# Altium schematic sheet Power management.SchDoc
size A4; SheetNumber: 2; SheetTotal: 5
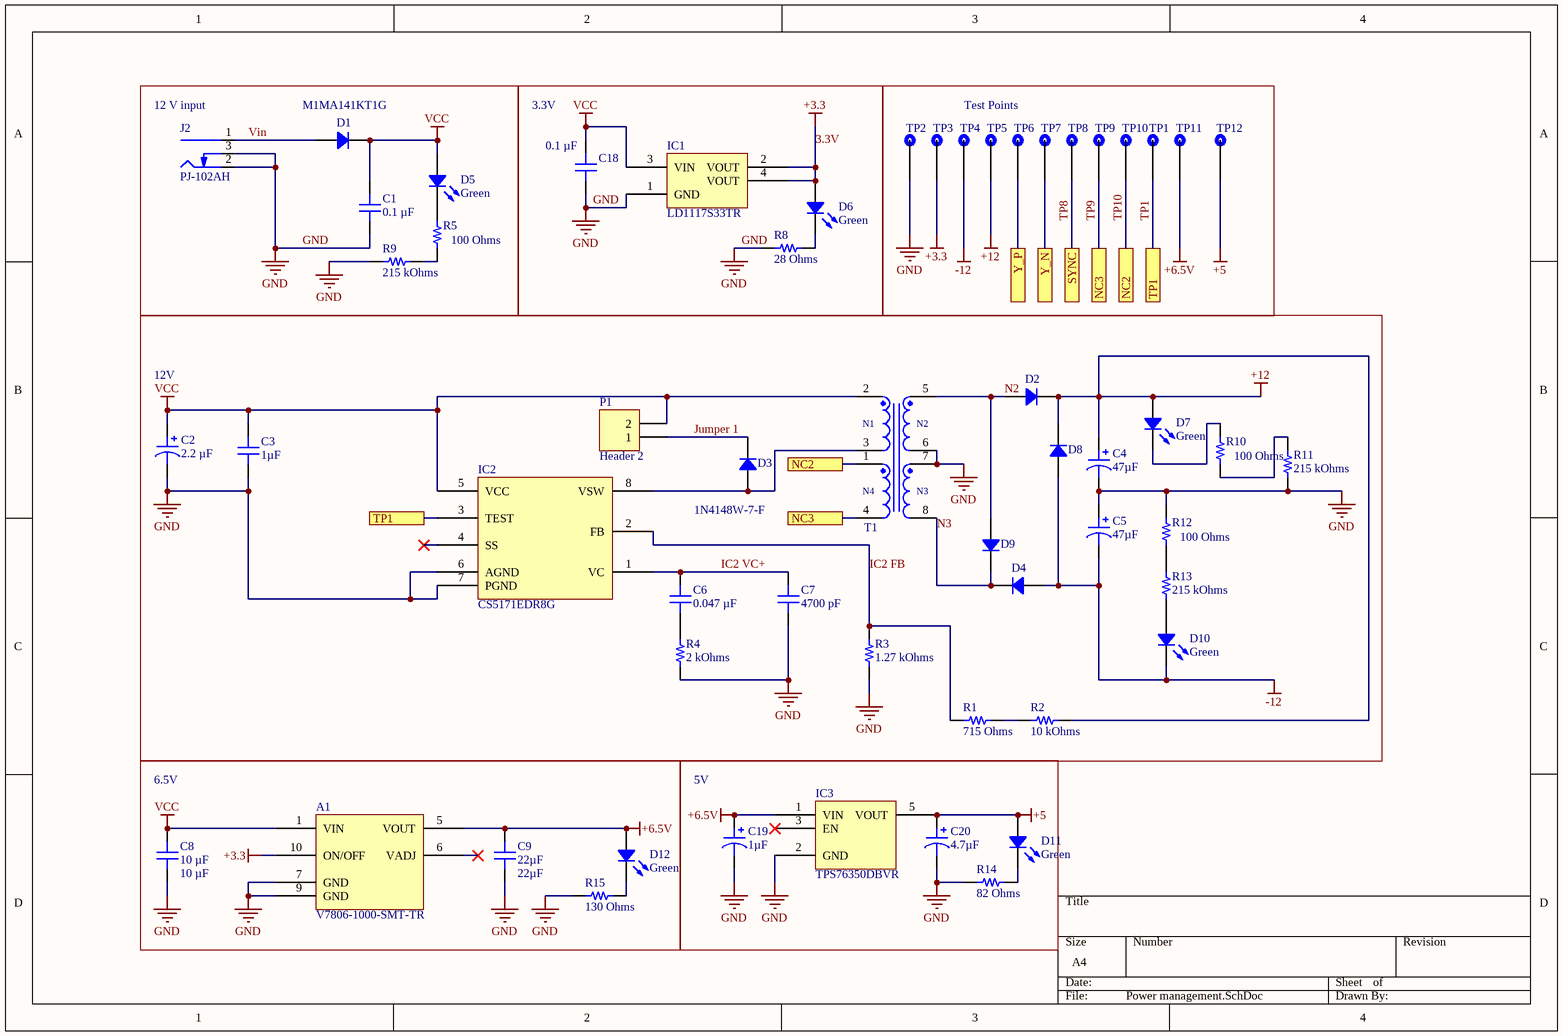
[diagram p0: Power management.SchDoc]

## Parts
A1  V7806-1000-SMT-TR  [CUI V78]
C1  0.1 µF  [CAP 0805_2012]
C2  2.2 µF  [CAP AL TH D8 L3.5 H12.5]
C3  1µF  [CAP 1206_3216 - 1.0MM]
C4  47µF  [CAP TH ALUM ELEC D6.30mm S2.50mm H12.70mm]
C5  47µF  [CAP TH ALUM ELEC D6.30mm S2.50mm H12.70mm]
C6  0.047 µF  [CAP 1206_3216 - 0.8MM]
C7  4700 pF  [CAP 1206_3216 - 0.8MM]
C8  10 µF  [CAP 1210_3225 - 1MM]
C9  22µF  [CAP 1210_3225 - 2.8MM]
C18  0.1 µF  [CAP 1210_3225 - 1MM]
C19  1µF  [CAP TH ALUM ELEC D4.00mm S1.50mm H6.00mm]
C20  4.7µF  [CAP TH ALUM ELEC D4.00mm S1.50mm H6.00mm]
D1  M1MA141KT1G  [DIODES SOT-323-3]
D2  MBRS140T3G  [DO214AA SMB]  (value not drawn)
D3  1N4148W-7-F  [SOD-123]
D4  MBRS140T3G  [DO214AA SMB]  (value not drawn)
D5  Green  [LED 1206_3216 GREEN]
D6  Green  [LED 1206_3216 GREEN]
D7  Green  [LED 1206_3216 GREEN]
D8  MBRS140T3G  [DO214AA SMB]  (value not drawn)
D9  MBRS140T3G  [DO214AA SMB]  (value not drawn)
D10  Green  [LED 1206_3216 GREEN]
D11  Green  [LED 1206_3216 GREEN]
D12  Green  [LED 1206_3216 GREEN]
IC1  LD1117S33TR  [ST SOT-223]
IC2  CS5171EDR8G  [ON SEMI SO-8]
IC3  TPS76350DBVR  [TI SOT-23-5 DBV]
J2  PJ-102AH  [CUI PJ-102AH]
P1  Header 2  [HDR1X2]
R1  715 Ohms  [RES 1210_3225]
R2  10 kOhms  [RES 1210_3225]
R3  1.27 kOhms  [RES 1210_3225]
R4  2 kOhms  [RES 1210_3225]
R5  100 Ohms  [RES 2512_6432]
R8  28 Ohms  [RES 2512_6432]
R9  215 kOhms  [RES 2512_6432]
R10  100 Ohms  [RES 2512_6432]
R11  215 kOhms  [RES 2512_6432]
R12  100 Ohms  [RES 2512_6432]
R13  215 kOhms  [RES 2512_6432]
R14  82 Ohms  [RES 2512_6432]
R15  130 Ohms  [RES 2512_6432]
T1  Ui = 30-57V, Uo1 = 12V/5A, Uo2 = -12V/1.6A  [WE-PoE++_EFD20_THT_L21.08W21.08H10.8]  (value not drawn)
TP1  TP_1  [Test_point_1]  (value not drawn)  (no BOM)
TP2  TP_1  [Test_point_1]  (value not drawn)  (no BOM)
TP3  TP_1  [Test_point_1]  (value not drawn)  (no BOM)
TP4  TP_1  [Test_point_1]  (value not drawn)  (no BOM)
TP5  TP_1  [Test_point_1]  (value not drawn)  (no BOM)
TP6  TP_1  [Test_point_1]  (value not drawn)  (no BOM)
TP7  TP_1  [Test_point_1]  (value not drawn)  (no BOM)
TP8  TP_1  [Test_point_1]  (value not drawn)  (no BOM)
TP9  TP_1  [Test_point_1]  (value not drawn)  (no BOM)
TP10  TP_1  [Test_point_1]  (value not drawn)  (no BOM)
TP11  TP_1  [Test_point_1]  (value not drawn)  (no BOM)
TP12  TP_1  [Test_point_1]  (value not drawn)  (no BOM)

## Blocks framed on the sheet
12 V input: C1 D1 D5 J2 R5 R9
3.3V: C18 D6 IC1 R8
Test Points: TP1-TP12
12V: C2-C7 D2-D4 D7-D10 IC2 P1 R1-R4 R10-R13 T1
6.5V: A1 C8 C9 D12 R15
5V: C19 C20 D11 IC3 R14

## Ports
NC2, NC3, SYNC, TP1, Y_N, Y_P

## Nets
3.3V: A1.10(ON/OFF) D6.1 IC1.2(VOUT) IC1.4(VOUT) TP3.TP1(P1)  [also labelled +3.3]
+5: C20.1 D11.1 IC3.5(VOUT) TP12.TP1(P1)
+6.5V: A1.5(VOUT) C9.2 C19.1 D12.1 IC3.1(VIN) TP11.TP1(P1)
+12: C4.1 D2.2 D7.1 D8.2 R2.2 TP5.TP1(P1)
-12: C5.2 D4.1 D8.1 D10.2 TP4.TP1(P1)
GND: A1.7(GND) A1.9(GND) C1.1 C2.2 C3.1 C4.2 C5.1 C7.1 C8.1 C9.1 C18.1 C19.2 C20.2 IC1.1(GND) IC2.6(AGND) IC2.7(PGND) IC3.2(GND) J2.2(Outer) J2.3(SW) R3.1 R4.1 R8.1 R9.1 R11.1 R12.2 R14.1 R15.1 T1.6 T1.7 TP2.TP1(P1)
VCC: A1.1(VIN) C1.2 C2.1 C3.2 C8.2 C18.2 D1.2 D5.1 IC1.3(VIN) IC2.5(VCC) P1.2 T1.2
IC2 FB: IC2.2(FB) R1.1 R3.2
IC2 VC+: C6.2 C7.2 IC2.1(VC)
Jumper 1: D3.2 P1.1
N2: D2.1 D9.1 T1.5
N3: D4.2 D9.2 T1.8
TP1: IC2.3(TEST) TP1.TP1(P1) ; port TP1
TP8: TP8.TP1(P1) ; port SYNC
TP9: T1.4 TP9.TP1(P1) ; port NC3
TP10: T1.1 TP10.TP1(P1) ; port NC2
Vin: D1.1 J2.1(Centre)
Y_N: TP7.TP1(P1) ; port Y_N
Y_P: TP6.TP1(P1) ; port Y_P
NetC6_1: C6.1 R4.2
NetD3_1: D3.1 IC2.8(VSW) T1.3
NetD5_2: D5.2 R5.2
NetD6_2: D6.2 R8.2
NetD7_2: D7.2 R10.2
NetD10_1: D10.1 R13.1
NetD11_2: D11.2 R14.2
NetD12_2: D12.2 R15.2
NetR1_2: R1.2 R2.1
NetR5_1: R5.1 R9.2
NetR10_1: R10.1 R11.2
NetR12_1: R12.1 R13.2

Not connected (* = marked no-connect by the designer): A1 6(VADJ)*; IC2 4(SS)*; IC3 3(EN)*

## Notes on the sheet
- (in symbol 750310042) N1; N2; N4; N3

## Library data of the parts
A1 = V7806-1000-SMT-TR: DC DC CONVERTER 6.5V 7W; Part Number: V7806-1000-SMT-TR
C1 = C0805X104K5RAC7210: .100UF 50.0V; manufacturer: KEMET; Temperature Coefficient: X7R; Tolerance: ±10%; Voltage - Rated: 50V; Part Number: C0805X104K5RAC7210; Value: 0.1 µF; Applications: Boardflex Sensitive; Capacitance: 0.1 µF; componentlink1description: Datasheet; componentlink1url: https://connect.kemet.com:7667/gateway/IntelliData-ComponentDocumentation/1.0/download/datasheet/C0805X104K5RAC7210; componentlink2description: DigiKey Link; componentlink2url: https://www.digikey.com/en/products/detail/kemet/C0805X104K5RAC7210/12082600; Device Package: 0805 (2012 Metric); Features: Soft Termination; lastupdated: 9/02/2024 8:14:45 PM; Lifecycle Status: Active; Minimum Order: 1; Mounting Type: Surface Mount, MLCC; Operating Temperature: -55°C ~ 125°C; Package / Case: 0805 (2012 Metric); packaging: TapeAndReel; partid: 48810; Part Status: Active; price: 0.05; series: SMD Comm X7R Flex; Size / Dimension: 0.079" L x 0.049" W (2.00mm x 1.25mm); Supplier 1: DigiKey; Supplier Part Number 1: 399-C0805X104K5RAC7210CT-ND; Thickness (Max): 0.039" (0.98mm)
C2 = UVY2G2R2MPD: CAP ALUM 2.2UF 20% 400V RADIAL; manufacturer: Nichicon; Lifetime @ Temp.: 1000 Hrs @ 105°C; Polarization: Polar; Ripple Current @ High Frequency: 31.05 mA @ 10 kHz; Ripple Current @ Low Frequency: 27 mA @ 120 Hz; Part Number: UVY2G2R2MPD; Applications: General Purpose; Capacitance: 2.2 µF; componentlink1description: Datasheet; componentlink1url: http://nichicon-us.com/english/products/pdfs/e-uvy.pdf; componentlink2description: DigiKey Link; componentlink2url: https://www.digikey.com/en/products/detail/nichicon/UVY2G2R2MPD/2539761; Device Package: Radial, Can; Height - Seated (Max): 0.492" (12.50mm); lastupdated: 8/02/2024 9:38:05 PM; Lead Spacing: 0.138" (3.50mm); Lifecycle Status: Active; Minimum Order: 1; Mounting Type: Through Hole; Operating Temperature: -40°C ~ 105°C; Package / Case: Radial, Can; packaging: Bulk; partid: 7299; Part Status: Active; price: 0.15; series: UVY; Size / Dimension: 0.315" Dia (8.00mm); Supplier 1: DigiKey; Supplier Part Number 1: 493-16197-ND; Tolerance: ±20%; value: 2.2 µF; Voltage - Rated: 400 V
C3 = 12065C105K4Z2A: CAP CER 1UF 50V X7R 1206; manufacturer: AVX Corporation; Tolerance: ±10%; Part Number: 12065C105K4Z2A; Value: 1µF; Applications: Automotive, Boardflex Sensitive; Capacitance: 1µF; componentlink1description: Datasheet; componentlink1url: http://datasheets.avx.com/AutoMLCC.pdf; componentlink2description: DigiKey Link; componentlink2url: http://digikey.com/product-detail/en/avx-corporation/12065C105K4Z2A/478-10886-1-ND/7536455; Device Package: 1206 (3216 Metric); Features: Soft Termination; lastupdated: 2/09/2020 1:05:06 AM; Lifecycle Status: Active; Minimum Order: 1; Mounting Type: Surface Mount, MLCC; Operating Temperature: -55°C ~ 125°C; Package / Case: 1206 (3216 Metric); packaging: TapeAndReel; partid: 18944; Part Status: Active; price: 0.12; Ratings: AEC-Q200; series: FLEXITERM®; Size / Dimension: 0.126" L x 0.063" W (3.20mm x 1.60mm); Supplier 1: DigiKey; Supplier Part Number 1: 478-10886-1-ND; Temperature Coefficient: X7R; Thickness (Max): 0.037" (0.94mm); Voltage - Rated: 50V
C4 C5 = EEU-FR1H470: AL LYTIC, RADIAL, 50VDC, 47UF; manufacturer: Panasonic Electronic Components; Impedance: 140 mOhms; Lifetime @ Temp.: 5000 Hrs @ 105°C; Polarization: Polar; Ripple Current @ High Frequency: 405mA @ 100kHz; Ripple Current @ Low Frequency: 283.5mA @ 120Hz; Tolerance: ±20%; Voltage - Rated: 50V; Part Number: EEU-FR1H470; Applications: General Purpose; Capacitance: 47µF; componentlink1description: Datasheet; componentlink1url: https://industrial.panasonic.com/cdbs/www-data/pdf/RDF0000/ABA0000C1022.pdf; componentlink2description: DigiKey Link; componentlink2url: http://digikey.com/product-detail/en/panasonic-electronic-components/EEU-FR1H470/P124235-ND/9921029; Device Package: Radial, Can; Height - Seated (Max): 0.500" (12.70mm); lastupdated: 4/09/2020 1:05:46 AM; Lead Spacing: 0.098" (2.50mm); Lifecycle Status: Active; Minimum Order: 1; Mounting Type: Through Hole; Operating Temperature: -40°C ~ 105°C; Package / Case: Radial, Can; packaging: Bulk; partid: 20220; Part Status: Active; price: 0.31; series: FR; Size / Dimension: 0.248" Dia (6.30mm); Supplier 1: DigiKey; Supplier Part Number 1: P124235-ND; value: 47µF
C6 = C1206C473K5RECAUTO: CAP CER 1206 47NF 50V X7R 10%; manufacturer: KEMET; Part Number: C1206C473K5RECAUTO; Value: 0.047 µF; Applications: Automotive, ESD Protection; Capacitance: 0.047 µF; componentlink1description: Datasheet; componentlink1url: https://api.kemet.com/component-edge/download/datasheet/C1206C473K5RECAUTO.pdf; componentlink2description: DigiKey Link; componentlink2url: https://www.digikey.com/en/products/detail/kemet/C1206C473K5RECAUTO/8640487; Device Package: 1206 (3216 Metric); lastupdated: 9/02/2024 8:18:49 PM; Lifecycle Status: Active; Minimum Order: 1; Mounting Type: Surface Mount, MLCC; Operating Temperature: -55°C ~ 125°C; Package / Case: 1206 (3216 Metric); packaging: TapeAndReel; partid: 19026; Part Status: Active; price: 0.03; Ratings: AEC-Q200; series: ESD SMD Auto X7R; Size / Dimension: 0.126" L x 0.063" W (3.20mm x 1.60mm); Supplier 1: DigiKey; Supplier Part Number 1: 399-17893-1-ND; Temperature Coefficient: X7R; Thickness (Max): 0.043" (1.10mm); Tolerance: ±10%; Voltage - Rated: 50V
C7 = GMC31CG472G50NT: CAP1206 COG 4700PF 2% 50V; manufacturer: Cal-Chip Electronics, Inc.; Temperature Coefficient: C0G, NP0; Part Number: GMC31CG472G50NT; Value: 4700 pF; Applications: General Purpose; Capacitance: 4700 pF; componentlink1description: Datasheet; componentlink1url: https://88ce57.p3cdn1.secureserver.net/wp-content/uploads/2023/01/gmc_series-2.pdf; componentlink2description: DigiKey Link; componentlink2url: https://www.digikey.com/en/products/detail/cal-chip-electronics-inc/GMC31CG472G50NT/19910712; Device Package: 1206 (3216 Metric); lastupdated: 9/02/2024 8:17:50 PM; Lifecycle Status: Active; Minimum Order: 1; Mounting Type: Surface Mount, MLCC; Operating Temperature: -55°C ~ 125°C; Package / Case: 1206 (3216 Metric); packaging: TapeAndReel; partid: 56643; price: 0.05; series: GMC; Size / Dimension: 0.126" L x 0.063" W (3.20mm x 1.60mm); Supplier 1: DigiKey; Supplier Part Number 1: 4713-GMC31CG472G50NTCT-ND; Thickness (Max): 0.037" (0.95mm); Tolerance: ±2%; Voltage - Rated: 50V
C8 = GCJ32EC71H106KA01L: CAP CER 10UF 50V X7S 1210; Part Number: GCJ32EC71H106KA01L; Value: 10 µF
C9 = 12103D226KAT2A: CAP CER 22UF 25V X5R 1210; Part Number: 12103D226KAT2A; Value: 22µF
C18 = C1210J104K2RAC7800: .100UF  200V; manufacturer: KEMET; Temperature Coefficient: X7R; Tolerance: ±10%; Part Number: C1210J104K2RAC7800; Value: 0.1 µF; Applications: Boardflex Sensitive; Capacitance: 0.1 µF; componentlink1description: Datasheet; componentlink1url: https://connect.kemet.com:7667/gateway/IntelliData-ComponentDocumentation/1.0/download/datasheet/C1210J104K2RAC7800; componentlink2description: DigiKey Link; componentlink2url: https://www.digikey.com/en/products/detail/kemet/C1210J104K2RAC7800/12082491; Device Package: 1210 (3225 Metric); Features: Open Mode, Soft Termination; lastupdated: 4/06/2024 7:20:48 PM; Lifecycle Status: Active; Minimum Order: 1; Mounting Type: Surface Mount, MLCC; Operating Temperature: -55°C ~ 125°C; Package / Case: 1210 (3225 Metric); packaging: TapeAndReel; partid: 49670; Part Status: Active; price: 0.24; series: SMD Comm X7R FO; Size / Dimension: 0.130" L x 0.102" W (3.30mm x 2.60mm); Supplier 1: DigiKey; Supplier Part Number 1: 399-C1210J104K2RAC7800CT-ND; Thickness (Max): 0.057" (1.45mm); Voltage - Rated: 200V
C19 = UMF1V010MDD: CAP ALUM 1UF 20% 35V RADIAL; manufacturer: Nichicon; Impedance: 5 Ohms; Lifetime @ Temp.: 1000 Hrs @ 105°C; Polarization: Polar; Ripple Current @ High Frequency: 50mA @ 100kHz; Ripple Current @ Low Frequency: 25mA @ 120Hz; Part Number: UMF1V010MDD; Applications: General Purpose; Capacitance: 1µF; componentlink1description: Datasheet; componentlink1url: http://nichicon-us.com/english/products/pdfs/e-umf.pdf; componentlink2description: DigiKey Link; componentlink2url: http://digikey.com/product-detail/en/nichicon/UMF1V010MDD/493-15541-ND/2598666; Device Package: Radial, Can; Height - Seated (Max): 0.236" (6.00mm); lastupdated: 6/09/2020 1:48:30 AM; Lead Spacing: 0.059" (1.50mm); Lifecycle Status: Active; Minimum Order: 1; Mounting Type: Through Hole; Operating Temperature: -55°C ~ 105°C; Package / Case: Radial, Can; packaging: Bulk; partid: 23219; Part Status: Active; price: 0.42; series: UMF; Size / Dimension: 0.157" Dia (4.00mm); Supplier 1: DigiKey; Supplier Part Number 1: 493-15541-ND; Tolerance: ±20%; value: 1µF; Voltage - Rated: 35V
C20 = UMF1V4R7MDD: CAP ALUM 4.7UF 20% 35V RADIAL; manufacturer: Nichicon; Impedance: 5 Ohms; Lifetime @ Temp.: 1000 Hrs @ 105°C; Polarization: Polar; Ripple Current @ High Frequency: 50mA @ 100kHz; Ripple Current @ Low Frequency: 25mA @ 120Hz; Part Number: UMF1V4R7MDD; Applications: General Purpose; Capacitance: 4.7µF; componentlink1description: Datasheet; componentlink1url: http://nichicon-us.com/english/products/pdfs/e-umf.pdf; componentlink2description: DigiKey Link; componentlink2url: http://digikey.com/product-detail/en/nichicon/UMF1V4R7MDD/493-15545-ND/2598673; Device Package: Radial, Can; Height - Seated (Max): 0.236" (6.00mm); lastupdated: 6/09/2020 1:48:30 AM; Lead Spacing: 0.059" (1.50mm); Lifecycle Status: Active; Minimum Order: 1; Mounting Type: Through Hole; Operating Temperature: -55°C ~ 105°C; Package / Case: Radial, Can; packaging: Bulk; partid: 23153; Part Status: Active; price: 0.42; series: UMF; Size / Dimension: 0.157" Dia (4.00mm); Supplier 1: DigiKey; Supplier Part Number 1: 493-15545-ND; Tolerance: ±20%; value: 4.7µF; Voltage - Rated: 35V
D1 = M1MA141KT1G: DIODE GEN PURP 40V 100MA SC70-3; Manufacturer: ON Semiconductor; Current - Average Rectified (Io): 100mA (DC); Current - Reverse Leakage @ Vr: 100nA @ 35V; Diode Type: Standard; Reverse Recovery Time (trr): 3ns; Speed: Small Signal =< 200mA (Io), Any Speed; Voltage - Forward (Vf) (Max) @ If: 1.2V @ 100mA; Part Number: M1MA141KT1G; ComponentLink1Description: Datasheet; ComponentLink1URL: http://www.onsemi.com/pub/Collateral/M1MA141KT1-D.PDF; ComponentLink2Description: DigiKey Link; ComponentLink2URL: http://digikey.com/product-detail/en/on-semiconductor/M1MA141KT1G/M1MA141KT1GOSCT-ND/917953; LastUpdated: 8/02/2024 9:34:01 PM; Lifecycle Status: Active; Minimum Order: 1; Mounting Type: Surface Mount; Operating Temperature - Junction: 150°C (Max); Package / Case: SC-70, SOT-323; Packaging: TapeAndReel; PartId: 8; Part Status: Active; Price: 0.03; Series: -; Supplier 1: DigiKey; Supplier Part Number 1: M1MA141KT1GOSCT-ND; Supplier Device Package: SC-70-3 (SOT323); Voltage - DC Reverse (Vr) (Max): 40V
D2 D4 D8 D9 = MBRS140T3G: DIODE SCHOTTKY 40V 1A SMB; Manufacturer: ON Semiconductor; Current - Reverse Leakage @ Vr: 1mA @ 40V; Speed: Fast Recovery =< 500ns, > 200mA (Io); Voltage - Forward (Vf) (Max) @ If: 600mV @ 1A; Part Number: MBRS140T3G; ComponentLink1Description: Datasheet; ComponentLink1URL: https://www.onsemi.com/pub/Collateral/MBRS140T3-D.PDF; ComponentLink2Description: DigiKey Link; ComponentLink2URL: http://digikey.com/product-detail/en/on-semiconductor/MBRS140T3G/MBRS140T3GOSCT-ND/918002; Current - Average Rectified (Io): 1A; Diode Type: Schottky; LastUpdated: 8/02/2024 9:26:46 PM; Lifecycle Status: Active; Minimum Order: 1; Mounting Type: Surface Mount; Operating Temperature - Junction: -65°C ~ 125°C; Package / Case: DO-214AA, SMB; Packaging: TapeAndReel; PartId: 1387; Part Status: Active; Price: 0.08; Series: -; Supplier 1: DigiKey; Supplier Part Number 1: MBRS140T3GOSCT-ND; Supplier Device Package: SMB; Voltage - DC Reverse (Vr) (Max): 40V
D3 = 1N4148W-7-F: DIODE GEN PURP 100V 300MA SOD123; Manufacturer: Diodes Incorporated; Capacitance @ Vr, F: 2pF @ 0V, 1MHz; Current - Reverse Leakage @ Vr: 1 µA @ 100 V; Diode Type: Standard; Reverse Recovery Time (trr): 4 ns; Speed: Fast Recovery =< 500ns, > 200mA (Io); Voltage - Forward (Vf) (Max) @ If: 1.25 V @ 150 mA; Part Number: 1N4148W-7-F; ComponentLink1Description: Datasheet; ComponentLink1URL: https://www.diodes.com/assets/Datasheets/ds30086.pdf; ComponentLink2Description: DigiKey Link; ComponentLink2URL: https://www.digikey.com/en/products/detail/diodes-incorporated/1N4148W-7-F/814371; Current - Average Rectified (Io): 300mA; LastUpdated: 8/02/2024 9:27:29 PM; Lifecycle Status: Active; Minimum Order: 1; Mounting Type: Surface Mount; Operating Temperature - Junction: -55°C ~ 150°C; Package / Case: SOD-123; Packaging: TapeAndReel; PartId: 1002; Part Status: Active; Price: 0.02; Series: -; Supplier 1: DigiKey; Supplier Part Number 1: 1N4148W-FDICT-ND; Supplier Device Package: SOD-123; Voltage - DC Reverse (Vr) (Max): 100 V
D5-D7 D10-D12 = XZVG60W: LED GREEN CLEAR 2SMD; Manufacturer: SunLED; Configuration: Standard; Current - Test: 20mA; Lens Color: Colorless; Lens Size: 2.00mm x 1.50mm; Lens Style: Rectangle with Flat Top; Millicandela Rating: 118mcd; Viewing Angle: 70°; Voltage - Forward (Vf) (Typ): 2.1V; Wavelength - Dominant: 570nm; Wavelength - Peak: 574nm; Part Number: XZVG60W; Color: Green; ComponentLink1Description: Datasheet; ComponentLink1URL: https://www.sunledusa.com/products/spec/XZVG60W.pdf; ComponentLink2Description: DigiKey Link; ComponentLink2URL: https://www.digikey.com/en/products/detail/sunled/XZVG60W/4902123; Device Package: 1206 (3216 Metric); Height (Max): 1.40mm; LastUpdated: 3/06/2024 7:59:11 PM; Lens Transparency: Clear; Lifecycle Status: Active; Minimum Order: 1; Mounting Type: Surface Mount; Package / Case: 1206 (3216 Metric); Packaging: TapeAndReel; PartId: 1002; Part Status: Active; Price: 0.07; Series: -; Size / Dimension: 3.00mm L x 1.50mm W; Supplier 1: DigiKey; Supplier Part Number 1: 1497-1398-1-ND; Supplier Device Package: 2-SMD; Value: Green
IC1 = LD1117S33TR: IC REG LINEAR 3.3V 800MA SOT223; Manufacturer: STMicroelectronics; Current - Quiescent (Iq): 10 mA; Number of Regulators: 1; Output Configuration: Positive; Output Type: Fixed; Protection Features: Over Current, Over Temperature; PSRR: 75dB (120Hz); Voltage Dropout (Max): 1.2V @ 800mA; Voltage - Input (Max): 15V; Part Number: LD1117S33TR; ComponentLink1Description: Datasheet; ComponentLink1URL: http://www.st.com/content/ccc/resource/technical/document/datasheet/99/3b/7d/91/91/51/4b/be/CD00000544.pdf/files/CD00000544.pdf/jcr:content/translations/en.CD00000544.pdf; ComponentLink2Description: DigiKey Link; ComponentLink2URL: https://www.digikey.com/en/products/detail/stmicroelectronics/LD1117S33TR/585766; Current - Output: 800mA; LastUpdated: 3/06/2024 8:14:20 PM; Lifecycle Status: Active; Minimum Order: 1; Mounting Type: Surface Mount; Operating Temperature: 0°C ~ 125°C; Package / Case: TO-261-4, TO-261AA; Packaging: TapeAndReel; Part Status: Active; Price: 0.13; Series: -; Supplier 1: DigiKey; Supplier Part Number 1: 497-1242-1-ND; Supplier Device Package: SOT-223; Voltage - Output (Min/Fixed): 3.3V
IC2 = CS5171EDR8G: IC REG MULT CONFG ADJ 1.5A 8SOIC; Manufacturer: ON Semiconductor; Current - Output: 1.5A (Switch); Frequency - Switching: 280kHz; Function: Step-Up, Step-Down, Step-Up/Step-Down; Number of Outputs: 1; Output Configuration: Positive or Negative; Output Type: Adjustable; Synchronous Rectifier: No; Topology: Buck, Boost, Flyback, Forward Converter, SEPIC; Voltage - Input (Max): 30V; Voltage - Input (Min): 2.7V; Voltage - Output (Max): 40V (Switch); Voltage - Output (Min/Fixed): 1.28V; Part Number: CS5171EDR8G; ComponentLink1Description: Datasheet; ComponentLink1URL: http://www.onsemi.com/pub/Collateral/CS5171-D.PDF; ComponentLink2Description: DigiKey Link; ComponentLink2URL: //digikey.com/product-detail/en/on-semiconductor/CS5171EDR8G/CS5171EDR8GOSTR-ND/918422; Device Package: 8-SOIC (0.154", 3.90mm Width); LastUpdated: 12/12/2019 8:27:18 AM; Lifecycle Status: 0; Minimum Order: 1; Mounting Type: Surface Mount; Operating Temperature: -40°C ~ 125°C (TJ); Package / Case: 8-SOIC (0.154", 3.90mm Width); Packaging: TapeAndReel; Part Status: Active; Price: 0.97; Series: -; Supplier 1: DigiKey; Supplier Part Number 1: CS5171EDR8GOSTR-ND; Supplier Device Package: 8-SOIC
IC3 = TPS76350DBVR: IC REG LINEAR 5V 150MA SOT23-5; Manufacturer: Texas Instruments; Control Features: Enable; Current - Quiescent (Iq): 100 µA; Current - Supply (Max): 140 µA; Number of Regulators: 1; Output Configuration: Positive; Output Type: Fixed; Protection Features: Over Current, Over Temperature, Reverse Polarity; PSRR: 60dB (1kHz); Voltage Dropout (Max): 0.3V @ 150mA; Voltage - Input (Max): 10V; Part Number: TPS76350DBVR; ComponentLink1Description: Datasheet; ComponentLink1URL: http://www.ti.com/general/docs/suppproductinfo.tsp?distId=10&gotoUrl=http%3A%2F%2Fwww.ti.com%2Flit%2Fgpn%2Ftps763; ComponentLink2Description: DigiKey Link; ComponentLink2URL: https://www.digikey.com/en/products/detail/texas-instruments/TPS76350DBVR/382163; Current - Output: 150mA; LastUpdated: 3/06/2024 8:14:19 PM; Lifecycle Status: Active; Minimum Order: 1; Mounting Type: Surface Mount; Operating Temperature: -40°C ~ 125°C; Package / Case: SC-74A, SOT-753; Packaging: TapeAndReel; Part Status: Active; Price: 0.22; Series: -; Supplier 1: DigiKey; Supplier Part Number 1: 296-11023-1-ND; Supplier Device Package: SOT-23-5; Voltage - Output (Min/Fixed): 5V
J2 = PJ-102AH: CONN PWR JACK 2X5.5MM SOLDER; Manufacturer: CUI Devices; Actual Diameter: 0.079" (2.00mm ID), 0.256" (6.50mm OD); Current Rating (Amps): 5A; Gender: Male; Industry Recognized Mating Diameter: 2.00mm ID (0.079"), 5.50mm OD (0.217"); Internal Switch(s): Single Switch, Normally Closed; Material Flammability Rating: UL94 V-0; Mating Length/Depth: 0.354" (9.00mm); Number of Positions/Contacts: 2 Conductors, 3 Contacts; Shielding: Unshielded; Voltage - Rated: 24VDC; Part Number: PJ-102AH; ComponentLink1Description: Datasheet; ComponentLink1URL: https://www.cuidevices.com/product/resource/digikeypdf/pj-102ah.pdf; ComponentLink2Description: DigiKey Link; ComponentLink2URL: //digikey.com/product-detail/en/cui-devices/PJ-102AH/CP-102AH-ND/408448; Connector Type: Jack; LastUpdated: 16/12/2019 7:01:27 PM; Lifecycle Status: 0; Minimum Order: 1; Mounting Type: Through Hole, Right Angle; Packaging: Tray; Part Status: Active; Price: 0.76; Series: -; Supplier 1: DigiKey; Supplier Part Number 1: CP-102AH-ND; Termination: Solder
P1 = Header 2: Header, 2-Pin; LatestRevisionDate: 17-Jul-2002; LatestRevisionNote: Re-released for DXP Platform.; Publisher: Altium Limited
R1 = CRCW1210715RFKEA: RES SMD 715 OHM 1% 1/2W 1210; Manufacturer: Vishay Dale; Power (Watts): 0.5W, 1/2W; Temperature Coefficient: ±100ppm/°C; Part Number: CRCW1210715RFKEA; ComponentLink1Description: Datasheet; ComponentLink1URL: http://www.vishay.com/docs/20035/dcrcwe3.pdf; ComponentLink2Description: DigiKey Link; ComponentLink2URL: https://www.digikey.com/en/products/detail/vishay-dale/CRCW1210715RFKEA/1177340; Composition: Thick Film; Device Package: 1210 (3225 Metric); Features: Automotive AEC-Q200; Height - Seated (Max): 0.024" (0.60mm); LastUpdated: 8/02/2024 9:49:36 PM; Lifecycle Status: Active; Minimum Order: 1; Number of Terminations: 2; Operating Temperature: -55°C ~ 155°C; Package / Case: 1210 (3225 Metric); Packaging: TapeAndReel; Part Status: Active; Price: 0.02; Ratings: AEC-Q200; Resistance: 715 Ohms; Series: CRCW; Size / Dimension: 0.126" L x 0.098" W (3.20mm x 2.50mm); Supplier 1: DigiKey; Supplier Part Number 1: 541-715AACT-ND; Supplier Device Package: 1210; Tolerance: ±1%; Value: 715 Ohms
R2 = ERJ-P14D1002U: RES SMD 10K OHM 0.5% 1/2W 1210; Manufacturer: Panasonic Electronic Components; Power (Watts): 0.5W, 1/2W; Temperature Coefficient: ±100ppm/°C; Part Number: ERJ-P14D1002U; ComponentLink1Description: Datasheet; ComponentLink1URL: https://industrial.panasonic.com/cdbs/www-data/pdf/RDO0000/AOA0000C331.pdf; ComponentLink2Description: DigiKey Link; ComponentLink2URL: https://www.digikey.com/en/products/detail/panasonic-electronic-components/ERJ-P14D1002U/3982725; Composition: Thick Film; Device Package: 1210 (3225 Metric); Features: Automotive AEC-Q200, Pulse Withstanding; Height - Seated (Max): 0.028" (0.70mm); LastUpdated: 8/02/2024 9:49:31 PM; Lifecycle Status: Active; Minimum Order: 1; Number of Terminations: 2; Operating Temperature: -55°C ~ 155°C; Package / Case: 1210 (3225 Metric); Packaging: TapeAndReel; Part Status: Active; Price: 0.07; Ratings: AEC-Q200; Resistance: 10 kOhms; Series: ERJ-P14; Size / Dimension: 0.126" L x 0.098" W (3.20mm x 2.50mm); Supplier 1: DigiKey; Supplier Part Number 1: P16083CT-ND; Supplier Device Package: 1210; Tolerance: ±0.5%; Value: 10 kOhms
R3 = ERJ-14NF1271U: RES SMD 1.27K OHM 1% 1/2W 1210; Manufacturer: Panasonic Electronic Components; Power (Watts): 0.5W, 1/2W; Temperature Coefficient: ±100ppm/°C; Part Number: ERJ-14NF1271U; ComponentLink1Description: Datasheet; ComponentLink1URL: https://industrial.panasonic.com/cdbs/www-data/pdf/RDA0000/AOA0000C304.pdf; ComponentLink2Description: DigiKey Link; ComponentLink2URL: https://www.digikey.com/en/products/detail/panasonic-electronic-components/ERJ-14NF1271U/383860; Composition: Thick Film; Device Package: 1210 (3225 Metric); Features: Automotive AEC-Q200; Height - Seated (Max): 0.028" (0.70mm); LastUpdated: 8/02/2024 9:49:38 PM; Lifecycle Status: Active; Minimum Order: 1; Number of Terminations: 2; Operating Temperature: -55°C ~ 155°C; Package / Case: 1210 (3225 Metric); Packaging: TapeAndReel; Part Status: Active; Price: 0.03; Ratings: AEC-Q200; Resistance: 1.27 kOhms; Series: ERJ-14N; Size / Dimension: 0.126" L x 0.098" W (3.20mm x 2.50mm); Supplier 1: DigiKey; Supplier Part Number 1: P1.27KAACT-ND; Supplier Device Package: 1210; Tolerance: ±1%; Value: 1.27 kOhms
R4 = RC1210JR-072KL: RES 2K OHM 5% 1/2W 1210; Manufacturer: Yageo; Power (Watts): 0.5W, 1/2W; Temperature Coefficient: ±100ppm/°C; Part Number: RC1210JR-072KL; ComponentLink1Description: Datasheet; ComponentLink1URL: https://www.yageo.com/upload/media/product/productsearch/datasheet/rchip/PYu-RC_Group_51_RoHS_L_11.pdf; ComponentLink2Description: DigiKey Link; ComponentLink2URL: https://www.digikey.com/en/products/detail/yageo/RC1210JR-072KL/5919910; Composition: Thick Film; Device Package: 1210 (3225 Metric); Features: Moisture Resistant; Height - Seated (Max): 0.024" (0.60mm); LastUpdated: 8/02/2024 9:49:20 PM; Lifecycle Status: Active; Minimum Order: 1; Number of Terminations: 2; Operating Temperature: -55°C ~ 155°C; Package / Case: 1210 (3225 Metric); Packaging: TapeAndReel; Part Status: Active; Price: 0.01; Resistance: 2 kOhms; Series: RC_L; Size / Dimension: 0.122" L x 0.102" W (3.10mm x 2.60mm); Supplier 1: DigiKey; Supplier Part Number 1: 13-RC1210JR-072KLCT-ND; Supplier Device Package: 1210; Tolerance: ±5%; Value: 2 kOhms
R5 R10 R12 = RK73H3ATTE1000F: RES 100 OHM 1% 1W 2512; manufacturer: KOA Speer Electronics, Inc.; Temperature Coefficient: ±100ppm/°C; Part Number: RK73H3ATTE1000F; componentlink1description: Datasheet; componentlink1url: http://www.koaspeer.com/catimages/Products/RK73H/RK73H.pdf; componentlink2description: DigiKey Link; componentlink2url: http://digikey.com/product-detail/en/koa-speer-electronics-inc/RK73H3ATTE1000F/2019-RK73H3ATTE1000FCT-ND/10425070; Composition: Thick Film; Device Package: 2512 (6432 Metric); Features: Automotive AEC-Q200, Moisture Resistant; Height - Seated (Max): 0.028" (0.70mm); lastupdated: 2/09/2020 1:26:50 AM; Lifecycle Status: Active; Minimum Order: 1; Number of Terminations: 2; Operating Temperature: -55°C ~ 155°C; Package / Case: 2512 (6432 Metric); packaging: TapeAndReel; Part Status: Active; Power (Watts): 1W; price: 0.05; Ratings: AEC-Q200; Resistance: 100 Ohms; series: RK73H; Size / Dimension: 0.248" L x 0.122" W (6.30mm x 3.10mm); Supplier 1: DigiKey; Supplier Part Number 1: 2019-RK73H3ATTE1000FCT-ND; Supplier Device Package: 2512; Tolerance: ±1%; value: 100 Ohms
R8 = RK73H3ATTE28R0F: RES 28 OHM 1% 1W 2512; manufacturer: KOA Speer Electronics, Inc.; Temperature Coefficient: ±100ppm/°C; Part Number: RK73H3ATTE28R0F; componentlink1description: Datasheet; componentlink1url: http://www.koaspeer.com/catimages/Products/RK73H/RK73H.pdf; componentlink2description: DigiKey Link; componentlink2url: http://digikey.com/product-detail/en/koa-speer-electronics-inc/RK73H3ATTE28R0F/2019-RK73H3ATTE28R0FCT-ND/10425047; Composition: Thick Film; Device Package: 2512 (6432 Metric); Features: Automotive AEC-Q200, Moisture Resistant; Height - Seated (Max): 0.028" (0.70mm); lastupdated: 11/04/2023 8:12:36 PM; Lifecycle Status: Active; Minimum Order: 1; Number of Terminations: 2; Operating Temperature: -55°C ~ 155°C; Package / Case: 2512 (6432 Metric); packaging: TapeAndReel; Part Status: Active; Power (Watts): 1W; price: 0.05; Ratings: AEC-Q200; Resistance: 28 Ohms; series: RK73H; Size / Dimension: 0.248" L x 0.122" W (6.30mm x 3.10mm); Supplier 1: DigiKey; Supplier Part Number 1: 2019-RK73H3ATTE28R0FCT-ND; Supplier Device Package: 2512; Tolerance: ±1%; value: 28 Ohms
R9 R11 R13 = CRCW2512215KFKEG: RES SMD 215K OHM 1% 1W 2512; manufacturer: Vishay Dale; Temperature Coefficient: ±100ppm/°C; Part Number: CRCW2512215KFKEG; componentlink1description: Datasheet; componentlink1url: http://www.vishay.com/docs/20035/dcrcwe3.pdf; componentlink2description: DigiKey Link; componentlink2url: http://digikey.com/product-detail/en/vishay-dale/CRCW2512215KFKEG/541-215KAFCT-ND/1178868; Composition: Thick Film; Device Package: 2512 (6432 Metric); Features: Automotive AEC-Q200; Height - Seated (Max): 0.028" (0.70mm); lastupdated: 16/04/2023 8:18:28 PM; Lifecycle Status: Active; Minimum Order: 1; Number of Terminations: 2; Operating Temperature: -55°C ~ 155°C; Package / Case: 2512 (6432 Metric); packaging: TapeAndReel; Part Status: Active; Power (Watts): 1W; price: 0.04; Ratings: AEC-Q200; Resistance: 215 kOhms; series: CRCW; Size / Dimension: 0.248" L x 0.124" W (6.30mm x 3.15mm); Supplier 1: DigiKey; Supplier Part Number 1: 541-215KAFCT-ND; Supplier Device Package: 2512; Tolerance: ±1%; value: 215 kOhms
R14 = CRGCQ2512F82R: RES 82 OHM 1% 1W 2512; manufacturer: TE Connectivity Passive Product; Temperature Coefficient: ±200ppm/°C; Part Number: CRGCQ2512F82R; componentlink1description: Datasheet; componentlink1url: https://www.te.com/commerce/DocumentDelivery/DDEController?Action=srchrtrv&DocNm=1773204-3&DocType=DS&DocLang=English; componentlink2description: DigiKey Link; componentlink2url: https://www.digikey.com/en/products/detail/te-connectivity-passive-product/CRGCQ2512F82R/8576582; Composition: Thick Film; Device Package: 2512 (6432 Metric); Features: Automotive AEC-Q200, Moisture Resistant; Height - Seated (Max): 0.026" (0.65mm); lastupdated: 17/02/2022 6:29:19 PM; Lifecycle Status: Active; Minimum Order: 1; Number of Terminations: 2; Operating Temperature: -55°C ~ 155°C; Package / Case: 2512 (6432 Metric); packaging: TapeAndReel; Part Status: Active; Power (Watts): 1W; price: 0.06; Ratings: AEC-Q200; Resistance: 82 Ohms; series: CRGCQ; Size / Dimension: 0.250" L x 0.126" W (6.35mm x 3.20mm); Supplier 1: DigiKey; Supplier Part Number 1: A129980CT-ND; Supplier Device Package: 2512; Tolerance: ±1%; value: 82 Ohms
R15 = CRCW2512130RFKEG: RES SMD 130 OHM 1% 1W 2512; manufacturer: Vishay Dale; Temperature Coefficient: ±100ppm/°C; Part Number: CRCW2512130RFKEG; componentlink1description: Datasheet; componentlink1url: http://www.vishay.com/docs/20035/dcrcwe3.pdf; componentlink2description: DigiKey Link; componentlink2url: http://digikey.com/product-detail/en/vishay-dale/CRCW2512130RFKEG/541-130AFCT-ND/3232072; Composition: Thick Film; Device Package: 2512 (6432 Metric); Features: Automotive AEC-Q200; Height - Seated (Max): 0.028" (0.70mm); lastupdated: 2/09/2020 1:26:55 AM; Lifecycle Status: Active; Minimum Order: 1; Number of Terminations: 2; Operating Temperature: -55°C ~ 155°C; Package / Case: 2512 (6432 Metric); packaging: TapeAndReel; Part Status: Active; Power (Watts): 1W; price: 0.04; Ratings: AEC-Q200; Resistance: 130 Ohms; series: CRCW; Size / Dimension: 0.248" L x 0.124" W (6.30mm x 3.15mm); Supplier 1: DigiKey; Supplier Part Number 1: 541-130AFCT-ND; Supplier Device Package: 2512; Tolerance: ±1%; value: 130 Ohms
T1 = 750310042: WE-PoE++ Power over Ethernet Plus Plus Transformer, THT, EFD20, Ui = 30-57V, Uo1 = 12V/5A, Uo2 = -12V/1.6A; Manufacturer: Wurth Elektronik; Auxiliary Voltage: 12V; Inductance: 154uH; Input Voltage: 30-57VDC; Insulation Test Voltage: 1500V; Leakage Inductance: 2uH; Output Current 1: 5A; Output Current 2: 1.6A; Output Voltage 2: -12V; Switching Frequency: 250-400kHz; Turns Ratio: 2:1:1:1; Manufacturer Part Number: 750310042; Category: Transformers For DC-DC Converter; Match Code: WE-PoE++; ComponentLink1Description: Website Link; ComponentLink1URL: https://www.we-online.com/redexpert/article/750310042?ad; ComponentLink2Description: Datasheet Link; ComponentLink2URL: https://www.we-online.com/redexpert/spec/750310042?ad; Mount: Through Hole; Operating Temperature Max: 125°C; Operating Temperature Min: -40°C; Packaging: Tape and Reel; Case/Size Code: EFD20; Length: 21.08mm; Width: 21.08mm; Height: 10.8mm; Output Voltage 1: 12V
TP1-TP12 = Test_point_1